# Altium schematic sheet Top-Sheet.SchDoc
size Letter; Organization: Cegep Limoilou; Address1: 1300, 8e Avenue; Address2: Québec, QC; Address3: Canada; Address4: G1J 5L5; Revision: Enseignants; SheetNumber: 1; SheetTotal: 4; Conception: Ilyes Gharmoul; Titre: ADAM FRONT-DOOR SYST; Modification: Ilyes G
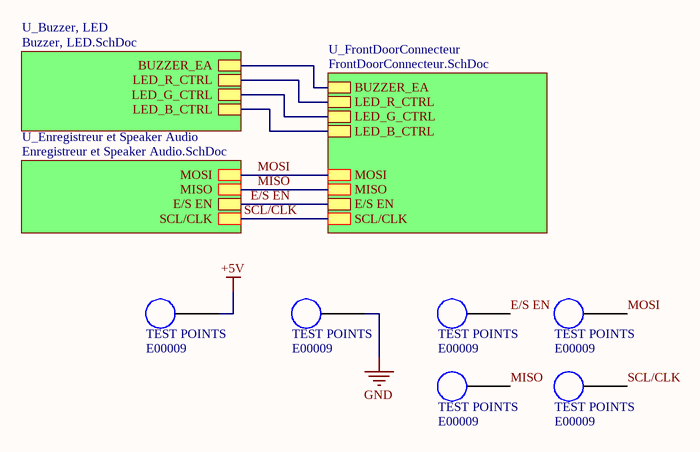
[diagram p0: Top-Sheet.SchDoc]

## Parts
T1  TEST POINTS  ADAM Inventory Number 1: E00009  [TEST POINTS]
T2  TEST POINTS  ADAM Inventory Number 1: E00009  [TEST POINTS]
T3  TEST POINTS  ADAM Inventory Number 1: E00009  [TEST POINTS]
T4  TEST POINTS  ADAM Inventory Number 1: E00009  [TEST POINTS]
T5  TEST POINTS  ADAM Inventory Number 1: E00009  [TEST POINTS]
T6  TEST POINTS  ADAM Inventory Number 1: E00009  [TEST POINTS]

## Sub-sheets
U_Buzzer, LED = Buzzer, LED.SchDoc: BUZZER_EA, LED_R_CTRL, LED_G_CTRL, LED_B_CTRL
U_Enregistreur et Speaker Audio = Enregistreur et Speaker Audio.SchDoc: MOSI, MISO, SCL/CLK, E/S EN
U_FrontDoorConnecteur = FrontDoorConnecteur.SchDoc: BUZZER_EA, LED_R_CTRL, LED_G_CTRL, LED_B_CTRL, MOSI, MISO, E/S EN, SCL/CLK

## Nets
+5V: T1.1
GND: T2.1
E/S EN: T3.1 ; sheet U_FrontDoorConnecteur/E/S EN, sheet U_Enregistreur et Speaker Audio/E/S EN
MISO: T5.1 ; sheet U_FrontDoorConnecteur/MISO, sheet U_Enregistreur et Speaker Audio/MISO
MOSI: T4.1 ; sheet U_FrontDoorConnecteur/MOSI, sheet U_Enregistreur et Speaker Audio/MOSI
SCL/CLK: T6.1 ; sheet U_FrontDoorConnecteur/SCL/CLK, sheet U_Enregistreur et Speaker Audio/SCL/CLK
(unnamed): sheet U_FrontDoorConnecteur/BUZZER_EA, sheet U_Buzzer, LED/BUZZER_EA
(unnamed): sheet U_FrontDoorConnecteur/LED_R_CTRL, sheet U_Buzzer, LED/LED_R_CTRL
(unnamed): sheet U_FrontDoorConnecteur/LED_G_CTRL, sheet U_Buzzer, LED/LED_G_CTRL
(unnamed): sheet U_FrontDoorConnecteur/LED_B_CTRL, sheet U_Buzzer, LED/LED_B_CTRL

## Notes on the sheet
- Titre :
- Conception :
- Date :
- Modification :
- Heure :
- Révision :
- Feuille
- de
- Fichier :

## Library data of the parts
T1-T6 = TEST POINTS: RCWCTE TEST POINTS; Manufacturer Part Number 1: RCWCTE